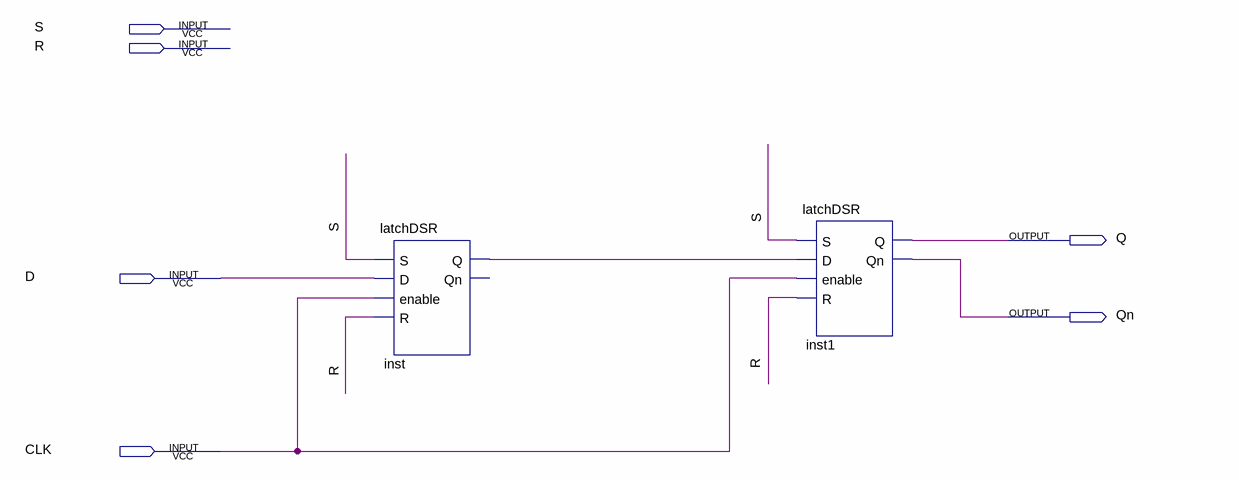
[diagram p0: schematic sheet]
// Quartus schematic dff.bdf as structural Verilog: 2 symbols, 6 pins
module dff (
  input  S,
  input  R,
  input  D,
  input  CLK,
  output Q,
  output Qn
);

  wire inst_q;

  latchDSR inst (.S(S), .D(D), .enable(CLK), .R(R), .Q(inst_q));  // open: Qn
  latchDSR inst1 (.S(S), .D(inst_q), .enable(CLK), .R(R), .Q(Q), .Qn(Qn));
endmodule
